# Altium schematic sheet RCU1.SchDoc
size 594 x 420 mm; Author: Прокофьев; Scale: 1:1; DocumentType: Схема электрическая принципиальная; FirstReferrence: АБВГ.123456.001
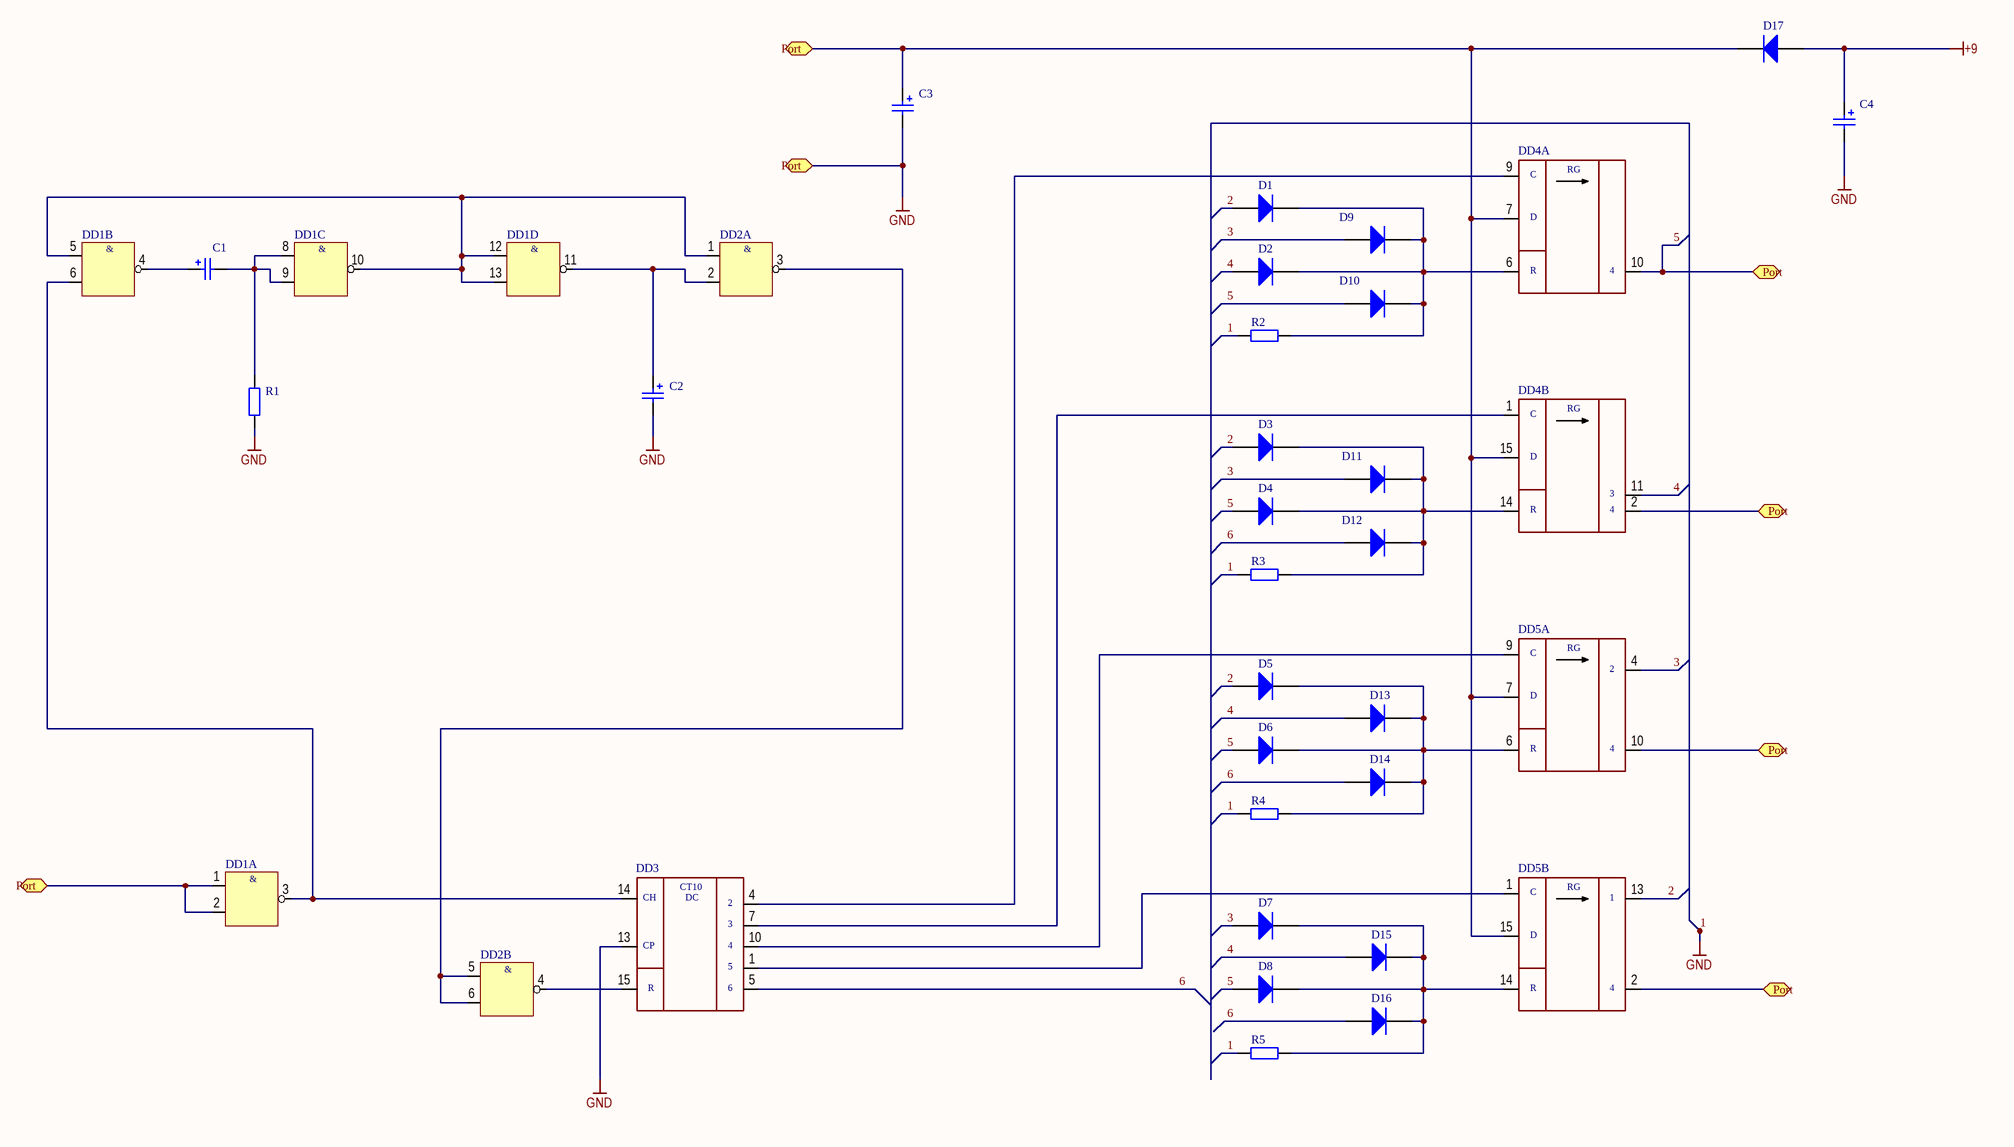
[diagram p0: RCU1.SchDoc]

## Parts
C1  (no value)  [POLAR0.8]
C2  (no value)  [POLAR0.8]
C3  Cap Pol2  [POLAR0.8]  (value not drawn)
C4  Cap Pol2  [POLAR0.8]  (value not drawn)
D1  Diode  [SMC]  (value not drawn)
D2  Diode  [SMC]  (value not drawn)
D3  Diode  [SMC]  (value not drawn)
D4  Diode  [SMC]  (value not drawn)
D5  Diode  [SMC]  (value not drawn)
D6  Diode  [SMC]  (value not drawn)
D7  Diode  [SMC]  (value not drawn)
D8  Diode  [SMC]  (value not drawn)
D9  Diode  [SMC]  (value not drawn)
D10  Diode  [SMC]  (value not drawn)
D11  Diode  [SMC]  (value not drawn)
D12  Diode  [SMC]  (value not drawn)
D13  Diode  [SMC]  (value not drawn)
D14  Diode  [SMC]  (value not drawn)
D15  Diode  [SMC]  (value not drawn)
D16  Diode  [SMC]  (value not drawn)
D17  Diode  [SMC]  (value not drawn)
DD1  (no value)  [DIP14]  (parts A,B,C,D of 4)
DD2  (no value)  [DIP14]  (parts A,B of 4)
DD3  L_DD3  [DIP16]  (value not drawn)
DD4  L_DD4  [DIP16]  (value not drawn)  (parts A,B of 2)
DD5  L_DD5  [DIP16]  (value not drawn)  (parts A,B of 2)
R1  (no value)  [AXIAL-0.4]
R2  Res2  [AXIAL-0.4]  (value not drawn)
R3  Res2  [AXIAL-0.4]  (value not drawn)
R4  Res2  [AXIAL-0.4]  (value not drawn)
R5  Res2  [AXIAL-0.4]  (value not drawn)

## Ports
Port

## Nets
1: C2.2 C3.1 C3.2 C4.2 D4.1(A) D6.1(A) D8.1(A) D10.1(A) D17.2(K) DD1.1 DD1.2 DD1.7 DD2.7 DD3.8 DD3.13 DD4.2 DD4.7 DD4.8 DD4.10 DD4.15 DD5.2 DD5.7 DD5.8 DD5.10 DD5.15 R1.1 R2.1 R3.1 R4.1 R5.1 ; port Port  [also labelled 5, GND]
+9: C4.1 D17.1(A)
Power: DD1.14 DD2.14 DD3.16 DD4.16 DD5.16
2: D1.1(A) D3.1(A) D5.1(A) DD5.13
3: D7.1(A) D9.1(A) D11.1(A) DD5.4
4: D2.1(A) D13.1(A) D15.1(A) DD4.11
6: D12.1(A) D14.1(A) D16.1(A) DD3.5
NetC1_1: C1.1 DD1.4
NetC1_2: C1.2 DD1.8 DD1.9 R1.2
NetC2_1: C2.1 DD1.11 DD2.2
NetD1_2: D1.2(K) D2.2(K) D9.2(K) D10.2(K) DD4.6 R2.2
NetD3_2: D3.2(K) D4.2(K) D11.2(K) D12.2(K) DD4.14 R3.2
NetD5_2: D5.2(K) D6.2(K) D13.2(K) D14.2(K) DD5.6 R4.2
NetD7_2: D7.2(K) D8.2(K) D15.2(K) D16.2(K) DD5.14 R5.2
NetDD1_3: DD1.3 DD1.6 DD3.14
NetDD1_5: DD1.5 DD1.10 DD1.12 DD1.13 DD2.1
NetDD2_3: DD2.3 DD2.5 DD2.6
NetDD2_4: DD2.4 DD3.15
NetDD3_1: DD3.1 DD5.1
NetDD3_4: DD3.4 DD4.9
NetDD3_7: DD3.7 DD4.1
NetDD3_10: DD3.10 DD5.9

## Notes on the sheet
- Перв. примен.
- Справ. №
- Подп. и дата
- Инв. № дубл.
- Взам. инв. №
- Разраб.
- Изм.
- Лист
- № докум.
- Подп.
- Дата
- Лит.
- Масса
- Масштаб
- Пров.
- Т.контр.
- Листов
- Инв. № подл.
- Утв.
- Н.контр.
- 2.106-A2
- Копировал
- Формат А2
- (in symbol L_DD1, part A) &
- (in symbol L_DD1, part B) &
- (in symbol L_DD1, part C) &
- (in symbol L_DD1, part D) &
- (in symbol L_DD3) CT10; CH; DC; 2; 3; CP; R; 6
- (in symbol L_DD4, part A) RG; C; D; R; 4
- (in symbol L_DD4, part B) RG; C; D; 3; R; 4
- (in symbol L_DD5, part A) RG; C; D; R
- (in symbol L_DD5, part B) C; RG; D; R

## Library data of the parts
C1 = Cap Pol2: Polarized Capacitor (Axial); Value: 2mF; Published: 8-Jun-2000; LatestRevisionDate: 17-Jul-2002; LatestRevisionNote: Re-released for DXP Platform.; PackageReference: POLAR0.8; Publisher: Altium Limited; PackageDescription: Polarized Capacitor; 2 Leads
C2 = Cap Pol2: Polarized Capacitor (Axial); Value: 1mF; Published: 8-Jun-2000; LatestRevisionDate: 17-Jul-2002; LatestRevisionNote: Re-released for DXP Platform.; PackageReference: POLAR0.8; Publisher: Altium Limited; PackageDescription: Polarized Capacitor; 2 Leads
C3 C4 = Cap Pol2: Polarized Capacitor (Axial); Value: 200mF; Published: 8-Jun-2000; LatestRevisionDate: 17-Jul-2002; LatestRevisionNote: Re-released for DXP Platform.; PackageReference: POLAR0.8; Publisher: Altium Limited; PackageDescription: Polarized Capacitor; 2 Leads
D1-D17 = Diode: Default Diode; Published: 8-Jun-2000; LatestRevisionDate: 17-Jul-2002; LatestRevisionNote: Re-released for DXP Platform.; PackageVersion: Sep-1996; PackageReference: SMC; Publisher: Altium Limited; PackageDescription: DO-214-AB/SMC; 2 C-Bend Leads; Body 7.9 x 5.9 mm, inc. leads (LxW); Code_JEDEC: DO-214-AB
DD1 DD2 = L_DD1
R1 = Res2: Resistor; Value: 30K; Published: 8-Jun-2000; LatestRevisionDate: 17-Jul-2002; LatestRevisionNote: Re-released for DXP Platform.; PackageReference: AXIAL-0.4; Publisher: Altium Limited; PackageDescription: Axial Device, Thru-Hole; 2 Leads; 0.4 in Pin Spacing
R2-R5 = Res2: Resistor; Value: 100K; Published: 8-Jun-2000; LatestRevisionDate: 17-Jul-2002; LatestRevisionNote: Re-released for DXP Platform.; PackageReference: AXIAL-0.4; Publisher: Altium Limited; PackageDescription: Axial Device, Thru-Hole; 2 Leads; 0.4 in Pin Spacing